# EAGLE design xkid_0.1 (EAGLE 6.5.0)
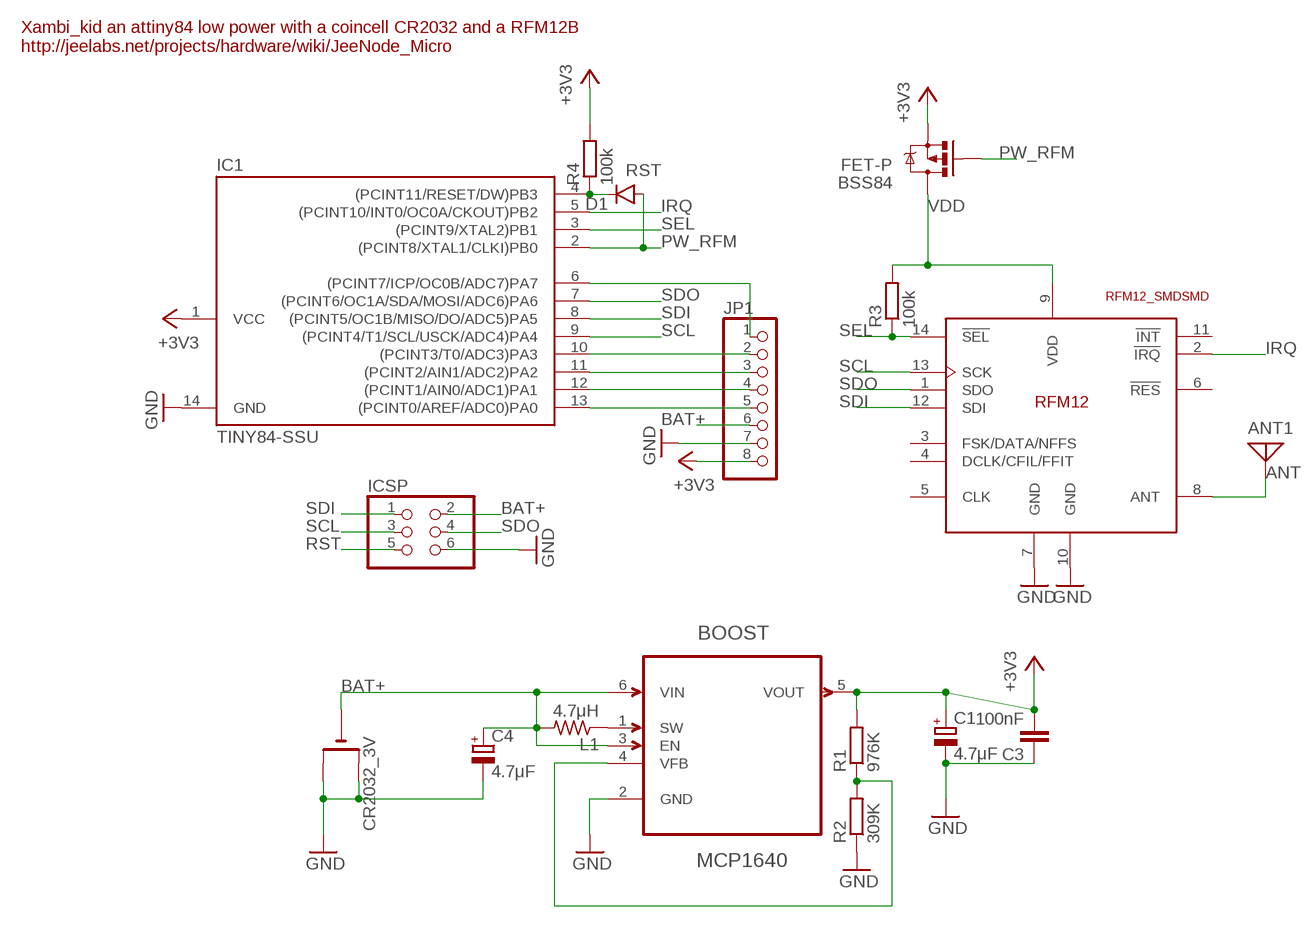
[diagram p0: schematic, sheet 1]

## Parts
ANT1  ANTENNA  [PAD-01]
BOOST  MCP1640  MCP1640BT-I/CHY  [SOT95P270X145-6N]
BSS84  FET-P  MOSFET-PCHANNEL  [SOT23-3]
C1  4.7μF  CPOL-EUCT3216  [CT3216]
C3  100nF  C-EUC0805K  [C0805K]
C4  4.7μF  CPOL-EUCT3216  [CT3216]
CR2032_3V  CR2032THM  [CR2032-THRU]
D1  DIODESOD  [SOD-323]
IC1  TINY84-SSU  TINY24/44/84-SSU  [SOIC14]
ICSP  PINHD-2X3  [2X03]
JP1  PINHD-1X8LOCK  [1X08-LOCK]
L1  4.7μH  R-US_0204/5  [0204/5]
R1  976K  R-EU_R0805  [R0805]
R2  309K  R-EU_R0805  [R0805]
R3  100k  R-EU_R0805  [R0805]
R4  100k  R-EU_R0805  [R0805]
U$1  RFM12_SMDSMD  [RFM12]

## Nets
+3V3: BOOST.5(VOUT) BSS84.2(S) C1.+ C3.2 IC1.1(VCC) JP1.8 R1.2 R4.2
ANT: ANT1.1 U$1.8(ANT)
BAT+: BOOST.3(EN) BOOST.6(VIN) C4.+ CR2032_3V.- ICSP.2 JP1.6 L1.2
GND: BOOST.2(GND) C1.- C3.1 C4.- CR2032_3V.+1(+) CR2032_3V.+2(+1) IC1.14(GND) ICSP.6 JP1.7 R2.1 U$1.7(GND) U$1.10(GND)
IRQ: IC1.5((PCINT10/INT0/OC0A/CKOUT)PB2) U$1.2(!IRQ)
N$1: BOOST.1(SW) L1.1
N$4: BOOST.4(VFB) R1.1 R2.2
N$5: IC1.6((PCINT7/ICP/OC0B/ADC7)PA7) JP1.1
N$6: IC1.10((PCINT3/T0/ADC3)PA3) JP1.2
N$7: IC1.11((PCINT2/AIN1/ADC2)PA2) JP1.3
N$8: IC1.12((PCINT1/AIN0/ADC1)PA1) JP1.4
N$9: IC1.13((PCINT0/AREF/ADC0)PA0) JP1.5
PW_RFM: BSS84.1(G) D1.A IC1.2((PCINT8/XTAL1/CLKI)PB0)
RST: D1.C IC1.4((PCINT11/RESET/DW)PB3) ICSP.5 R4.1
SCL: IC1.9((PCINT4/T1/SCL/USCK/ADC4)PA4) ICSP.3 U$1.13(SCK)
SDI: IC1.8((PCINT5/OC1B/MISO/DO/ADC5)PA5) ICSP.1 U$1.12(SDI)
SDO: IC1.7((PCINT6/OC1A/SDA/MOSI/ADC6)PA6) ICSP.4 U$1.1(SDO)
SEL: IC1.3((PCINT9/XTAL2)PB1) R3.1 U$1.14(!SEL)
VDD: BSS84.3(D) R3.2 U$1.9(VDD)
Unconnected: U$1.3(FSK/DATA/NFFS) U$1.4(DCLK/CFIL/FFIT) U$1.5(CLK) U$1.6(!RES) U$1.11(!INT)

## Notes on the sheet
- Xambi_kid an attiny84 low power with a coincell CR2032 and a RFM12B
  http://jeelabs.net/projects/hardware/wiki/JeeNode_Micro

## Library data of the parts
ANT1 = discrete:ANTENNA: Antenna
BOOST = xpix:MCP1640BT-I/CHY: Synchronous Boost Regulator; MPN: MCP1640BT-I/CHY; OC_FARNELL: 1800207; OC_NEWARK: 73R3625; PACKAGE: SOT-6; SUPPLIER: Microchip
BSS84 = SparkFun-DiscreteSemi:MOSFET-PCHANNEL: Generic PMOSFET IRLML2244 - TRANS-11153 (SOT-23 -20V -4.3A) (1.Gate 2.Source 3.Drain) FQP27P06 - COM-10349 <http://www.sparkfun.com/products/10349> (TO-220 -60V -27A) (1.Gate 2.Source 3.Drain); PROD_ID: TRANS-08285
C1 C4 = rcl:CPOL-EU: POLARIZED CAPACITOR, European symbol
C3 = rcl:C-EU: CAPACITOR, European symbol
CR2032_3V = _adafruit:CR2032
D1 = SparkFun-DiscreteSemi:DIODE: Diode These are standard reverse protection diodes and small signal diodes. SMA package can handle up to about 1A. SOD-323 can handle about 200mA. What the SOD-323 package when ordering, there are some mfgs out there that are 5-pin packages.; PROD_ID: DIO-09646
IC1 = avr-7:TINY24/44/84
ICSP = pinhead:PINHD-2X3: PIN HEADER
JP1 = _adafruit:PINHD-1X8: PIN HEADER
L1 = _adafruit:R-US_: RESISTOR, American symbol
R1-R4 = rcl:R-EU_: RESISTOR, European symbol
U$1 = rfm_12:RFM12_SMD: RFM12 is a low costing ISM band transceiver module implemented with unique PLL. It works signal ranges from 315/433/868/915MHZ bands, comply with FCC, ETSI regulation. The SPI interface is used to communicate with microcontroller for parameter setting.

## Board
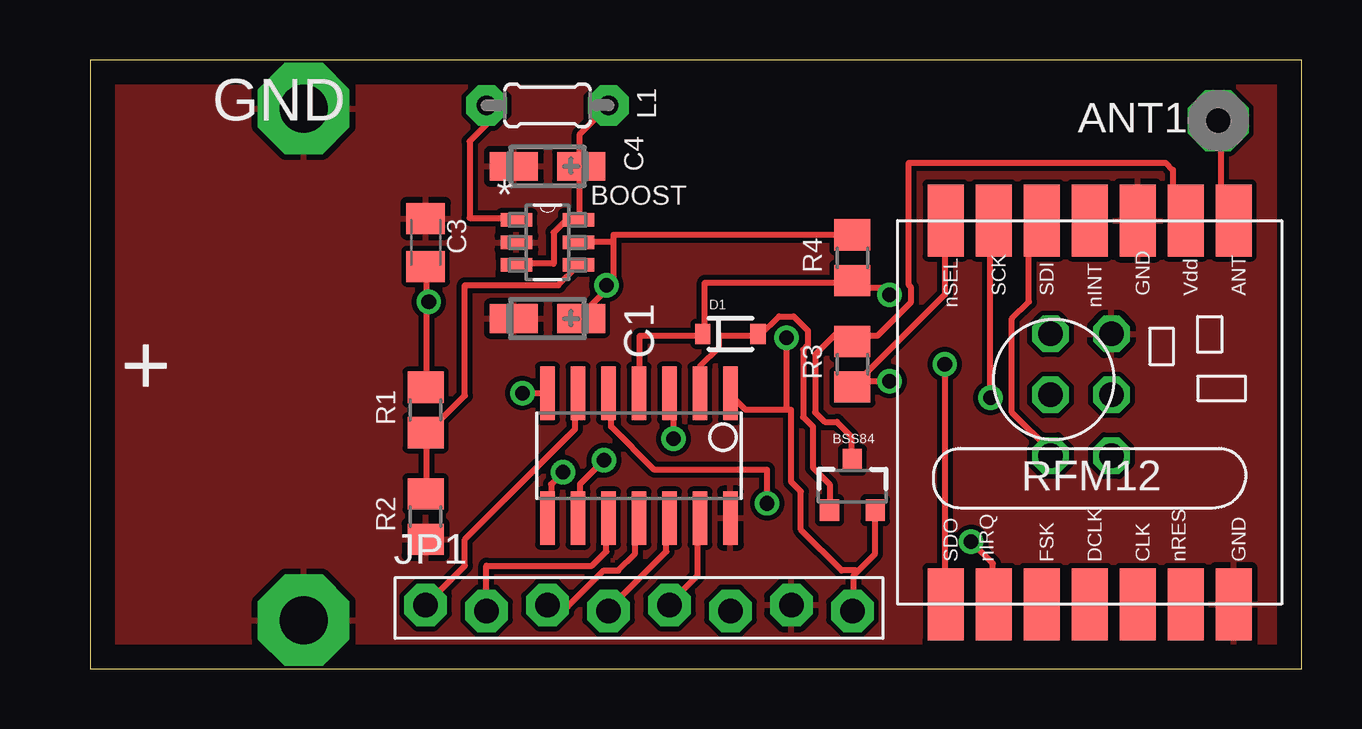
[diagram p1: board, top side]
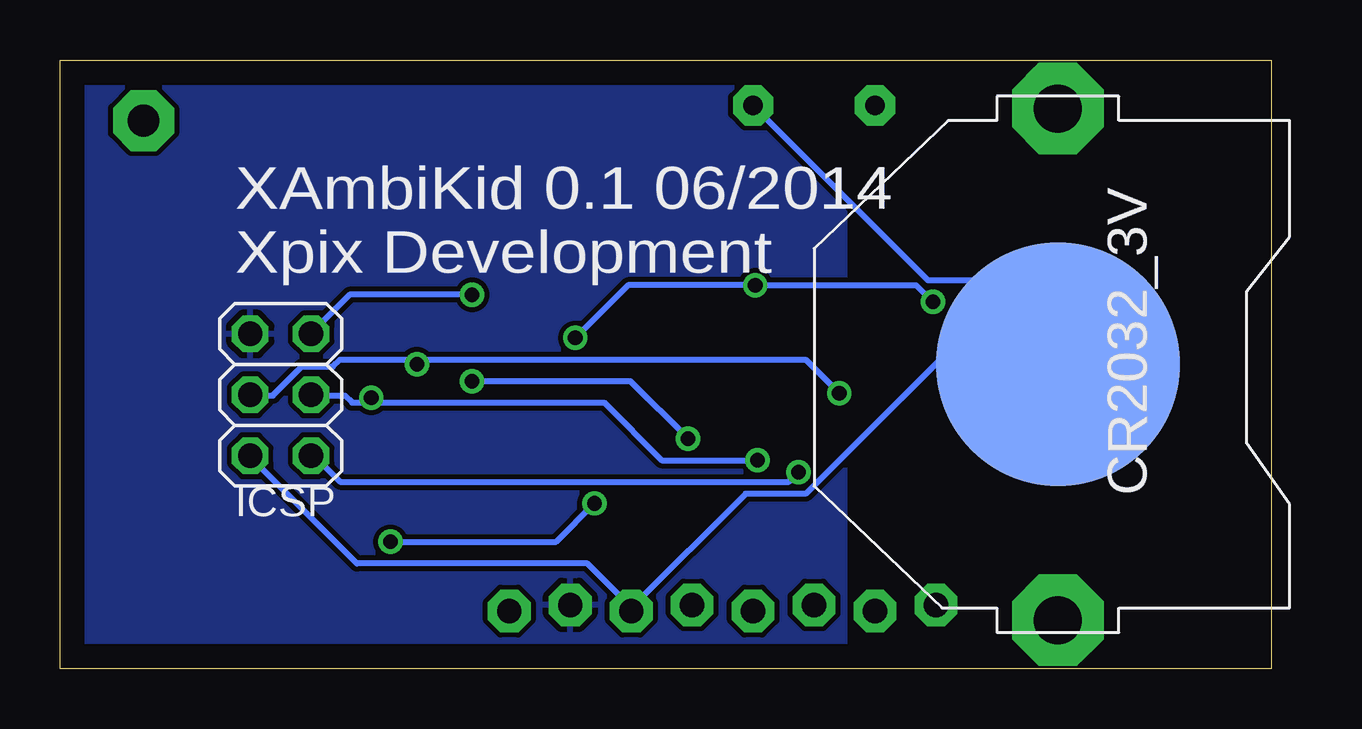
[diagram p2: board, bottom side, seen from below]

Size 50.47 x 25.39 mm. Coordinates in mm from the lower left corner, seen from the top.
Outline: 0,0 50.47,0 50.47,25.39 0,25.39 0,0
Copper layers (1*16): Top 0.035mm / dielectric 1.5mm / Bottom 0.035mm
Design rules "default": minimum track width 10mil, minimum drill 24mil, track to track 8mil, track to pad 8mil, pad to pad 8mil, via to via 8mil, smd to smd 8mil, copper to edge 40mil, drill to drill 8mil, minimum pad ring 10mil, minimum via ring 8mil, stop-mask expansion 4mil, vias tented up to drill 0mil, thermal gap 10mil

### Footprints (pad centres in the part's own frame; a part is rotated, then mirrored left to right if it is on the bottom)
PAD-01 = drill 1.321 pad 2.54 octagon: 1 0,0
SOT95P270X145-6N = smd 1.321 x 0.559: 1 -1.295,0.94; 2 -1.295,0; 3 -1.295,-0.94; 4 1.295,-0.94; 5 1.295,0; 6 1.295,0.94
SOT23-3 = smd 0.8 x 0.9: 1 -0.95,-1; 2 0.95,-1; 3 0,1.1
CT3216 = smd 2 x 1.2: + -1.4,0; - 1.4,0
C0805K = smd 1.3 x 1.6: 1 -1,0; 2 1,0
CR2032-THRU = drill 2 pad 3.81 octagon: +1 -10.668,0; +2 10.668,0 | smd 10.16 x 10.16: - 0,0
SOD-323 = smd 0.63 x 0.83: A 1.15,0; C -1.15,0
SOIC14 = smd 0.61 x 2.21: 1 -3.81,-2.603; 2 -2.54,-2.603; 3 -1.27,-2.603; 4 0,-2.603; 5 1.27,-2.603; 6 2.54,-2.603; 7 3.81,-2.603; 8 3.81,2.603; 9 2.54,2.603; 10 1.27,2.603; 11 0,2.603; 12 -1.27,2.603; 13 -2.54,2.603; 14 -3.81,2.603
2X03 = drill 1.016 octagon: 1 -2.54,-1.27; 2 -2.54,1.27; 3 0,-1.27; 4 0,1.27; 5 2.54,-1.27; 6 2.54,1.27
1X08-LOCK = drill 1.016 pad 1.778 octagon: 1 -8.89,0.127; 2 -6.35,-0.127; 3 -3.81,0.127; 4 -1.27,-0.127; 5 1.27,0.127; 6 3.81,-0.127; 7 6.35,0.127; 8 8.89,-0.127
0204/5 = drill 0.813 pad 1.676 octagon: 1 -2.54,0; 2 2.54,0
R0805 = smd 1.3 x 1.5: 1 -0.95,0; 2 0.95,0
RFM12 = smd 1.5 x 3: 1 -5,-10; 2 -3,-10; 3 -1,-10; 4 1,-10; 5 3,-10; 6 5,-10; 7 7,-10; 8 7,6; 9 5,6; 10 3,6; 11 1,6; 12 -1,6; 13 -3,6; 14 -5,6

### Placement (x,y rotation side)
ANT1  46.99,22.86 0 top
BOOST  19.05,17.78 0 top
BSS84  31.75,7.62 0 top
C1  19.05,14.61 180 top
C3  13.97,17.78 270 top
C4  19.05,20.95 180 top
CR2032_3V  8.89,12.7 270 bottom
D1  26.67,13.97 0 top
IC1  22.86,8.89 180 top
ICSP  41.27,11.43 90 bottom
JP1  22.86,2.54 0 top
L1  19.05,23.5 0 top
R1  13.97,10.79 90 top
R2  13.97,6.35 90 top
R3  31.75,12.7 90 top
R4  31.75,17.14 90 top
U$1  40.64,12.7 0 top

### Tracks (layer width: path | path; a pad name or v marks a point on that pad's centre or on a via)
+3V3  (via drill 0.61)
  Top 0.254: BSS84.2 32.7,4.8 31.95,4.05 | 31.95,4.05 31.8,3.9 31.8,2.5 JP1.8 | 29,10.8 29.2,10.8 29.2,7.8 29.6,7.4 29.6,5.8 31.3,4.1 31.9,4.1 31.95,4.05 | 29,10.8 27.3,10.8 26.7,11.4 IC1.1 | 14,15.3 14,16.7 C3.2 | 14,15.3 14,11.8 R1.2 | 21.8,17.8 20.4,17.8 BOOST.5 | 21.8,17.8 21.8,16.1 21.65,15.95 | 21.65,15.95 20.5,14.8 20.5,14.7 C1.+ | 21.8,17.8 21.8,18.1 31.7,18.1 R4.2 | v21.5,16 21.6,16 21.65,15.95 | v14.1,15.3 14,15.3 | v29,13.8 29,10.8
  Bottom 0.254: v14.1,15.3 14.8,16 v21.5,16 26.8,16 v29,13.8
ANT
  Top 0.254: U$1.8 47.6,18.7 47.1,19.2 47.1,22.7 47,22.8 ANT1.1
BAT+
  Top 0.254: BOOST.3 17.8,16.9 19.3,16.9 19.3,18.2 19.8,18.7 20.3,18.7 BOOST.6 20.4,18.8 20.4,20.9 C4.+ 20.4,21 20.4,22.3 21.5,23.4 L1.2
  Bottom 0.254: ICSP.2 42.5,8.8 38.1,4.4 28.5,4.4 26.6,2.5 JP1.6 26.6,2.6 21.9,7.3 19.4,7.3 11.5,15.2 CR2032_3V.- 12.4,16.2 14.3,16.2 21.5,23.4 L1.2
GND
  pour Bottom: 17.78,0 17.78,30.48 50.8,30.48 50.8,0
  pour Top: 0,0 0,30.48 50.8,30.48 50.8,0
IRQ  (via drill 0.61)
  Top 0.254: v28.2,6.9 28.2,8.3 23.5,8.3 21.7,10.1 21.7,11.3 21.6,11.4 IC1.5 | v36.7,5.3 37.6,4.4 37.6,2.7 U$1.2
  Bottom 0.254: v28.2,6.9 29.8,5.3 v36.7,5.3
N$1
  Top 0.254: BOOST.1 17.7,18.8 15.8,18.8 15.8,22 16.5,22.7 16.5,23.4 L1.1
N$4
  Top 0.254: BOOST.4 20.3,16.8 19.5,16 15.6,16 15.6,11.4 14,9.8 R1.1 14,9.7 14,7.3 R2.2
N$5
  Top 0.254: IC1.6 20.3,11.4 20.2,11.3 20.2,10 15.6,5.4 15.6,4.3 14,2.7 JP1.1
N$6
  Top 0.254: IC1.10 21.5,6.2 21.5,4.9 20.9,4.3 16.5,4.3 16.5,2.5 JP1.2
N$7
  Top 0.254: IC1.11 22.8,6.2 22.7,6.1 22.7,4.8 22,4.1 21.4,4.1 19.9,2.6 19.1,2.6 JP1.3
N$8
  Top 0.254: IC1.12 24.1,6.2 24,6.1 24,4.9 21.6,2.5 JP1.4
N$9
  Top 0.254: IC1.13 25.4,6.2 25.3,6.1 25.3,3.9 24.2,2.8 24.2,2.7 JP1.5
PW_RFM
  Top 0.254: IC1.2 25.4,12.6 26.2,13.4 26.2,13.9 27.8,13.9 D1.A 27.9,13.9 28.7,14.7 29.3,14.7 29.9,14.1 29.9,13.5 29.7,13.3 29.7,10.5 30.1,10.1 30.1,8.4 30.8,7.7 BSS84.1
RST  (via drill 0.61)
  Top 0.254: IC1.4 22.9,11.5 22.9,13.9 25.5,13.9 D1.C 25.6,14 25.6,16.1 31.7,16.1 R4.1 31.7,16 31.7,15.9 33,15.9 v33.3,15.6
  Bottom 0.254: v33.3,15.6 38.4,15.6 40,14 ICSP.5
SCL  (via drill 0.61)
  Top 0.254: v21.4,8.7 20.4,7.7 20.4,6.3 IC1.9 | v37.5,11.3 37.5,18.6 37.6,18.7 U$1.13
  Bottom 0.254: v21.4,8.7 25.4,8.7 27.8,11.1 37.5,11.1 | 37.5,11.1 38.3,11.1 38.6,11.4 40,11.4 ICSP.3 | v37.5,11.3 37.5,11.1
SDI  (via drill 0.61)
  Top 0.254: v19.7,8.2 19.2,7.7 19.2,6.4 19.1,6.3 IC1.8 | U$1.12 39.6,18.7 39.1,18.2 39.1,15.3 38.4,14.6 38.4,10.7 40,9.1 ICSP.1
  Bottom 0.254: v19.7,8.2 20.1,7.8 38.8,7.8 39.8,8.8 40,8.8 ICSP.1
SDO  (via drill 0.61)
  Top 0.254: v18,11.5 19,11.5 IC1.7 | v35.6,12.7 35.6,2.7 U$1.1
  Bottom 0.254: v18,11.5 19.4,12.9 35.6,12.9 | 35.6,12.9 38.8,12.9 39.1,12.6 40.4,12.6 41.6,11.4 42.5,11.4 ICSP.4 | v35.6,12.7 35.6,12.9
SEL  (via drill 0.61)
  Top 0.254: U$1.14 35.6,18.7 35.6,15.6 R3.1 32.1,12 v33.3,12 | v24.3,9.6 24.3,11.3 24.2,11.4 IC1.3
  Bottom 0.254: v24.3,9.6 26.7,12 v33.3,12
VDD
  Top 0.254: U$1.9 45.6,18.7 45.1,19.2 45.1,20.8 44.8,21.1 34.1,21.1 34.1,16 34.2,15.9 34.2,15.3 32.8,13.9 31.7,13.9 31.7,13.8 R3.2 31.7,14 31.1,14 30.2,13.1 30.2,10.7 30.6,10.3 31.1,10.3 31.7,9.7 31.7,8.8 BSS84.3

### Text on the board
tNames: GND | +
bNames: XAmbiKid 0.1 06/2014 / Xpix Development